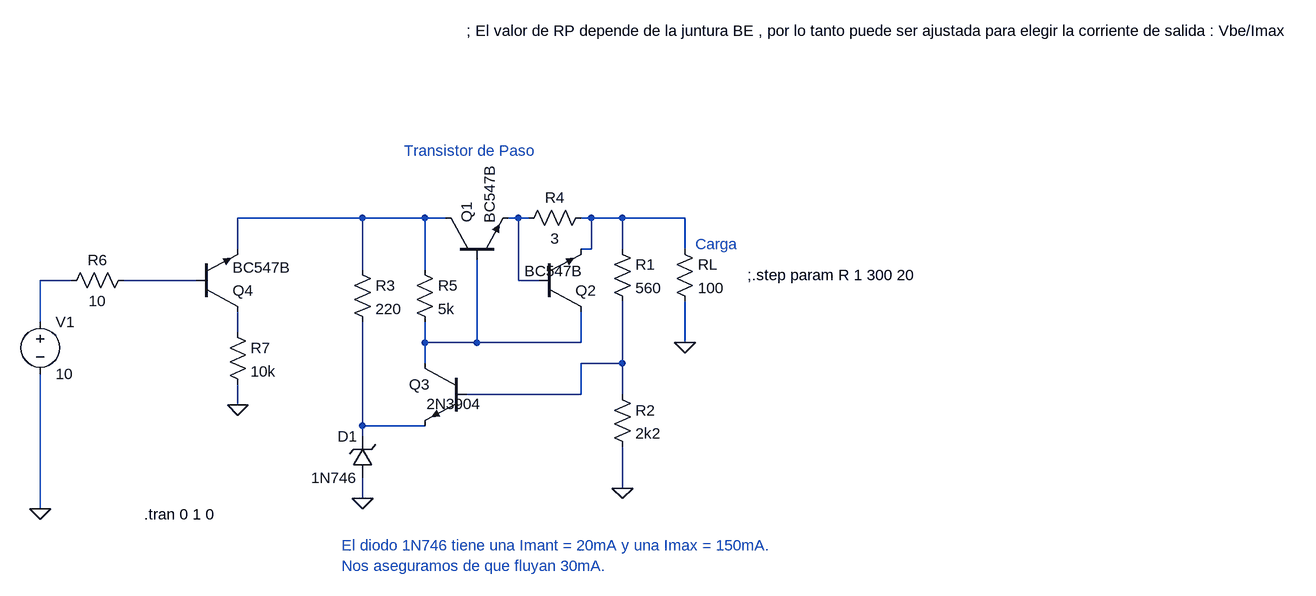
[diagram p0: schematic Fuente.asc]
Fuente.asc, the LTspice schematic file:
Version 4
SHEET 1 1496 680
WIRE -48 -48 -240 -48
WIRE 48 -48 -48 -48
WIRE 80 -48 48 -48
WIRE 192 -48 176 -48
WIRE 208 -48 192 -48
WIRE 304 -48 288 -48
WIRE 352 -48 304 -48
WIRE 448 -48 352 -48
WIRE -240 0 -240 -48
WIRE 304 0 304 -48
WIRE 304 0 288 0
WIRE 352 0 352 -48
WIRE 448 0 448 -48
WIRE -48 32 -48 -48
WIRE 48 32 48 -48
WIRE -496 48 -544 48
WIRE -304 48 -416 48
WIRE 192 48 192 -48
WIRE 224 48 192 48
WIRE -544 112 -544 48
WIRE -240 128 -240 96
WIRE 48 144 48 112
WIRE 128 144 128 16
WIRE 128 144 48 144
WIRE 288 144 288 96
WIRE 288 144 128 144
WIRE 448 144 448 80
WIRE 48 176 48 144
WIRE 352 176 352 80
WIRE 352 176 288 176
WIRE 288 224 288 176
WIRE 288 224 112 224
WIRE 352 224 352 176
WIRE -240 240 -240 208
WIRE -48 272 -48 112
WIRE 48 272 -48 272
WIRE -48 288 -48 272
WIRE 352 368 352 304
WIRE -48 384 -48 352
WIRE -544 400 -544 192
FLAG -544 400 0
FLAG -48 384 0
FLAG 352 368 0
FLAG 448 144 0
FLAG -240 240 0
DATAFLAG 432 -48 ""
DATAFLAG -80 -48 ""
SYMBOL npn 80 16 R270
SYMATTR InstName Q1
SYMATTR Value BC547B
SYMBOL res 336 -16 R0
SYMATTR InstName R1
SYMATTR Value 560
SYMBOL res 336 208 R0
SYMATTR InstName R2
SYMATTR Value 2k2
SYMBOL res -64 16 R0
SYMATTR InstName R3
SYMATTR Value 220
SYMBOL voltage -544 96 R0
WINDOW 123 0 0 Left 0
WINDOW 39 0 0 Left 0
SYMATTR InstName V1
SYMATTR Value 10
SYMBOL res 432 -16 R0
SYMATTR InstName RL
SYMATTR Value 100
SYMBOL npn 224 96 M180
WINDOW 3 -23 62 Left 2
SYMATTR Value BC547B
SYMATTR InstName Q2
SYMBOL res 304 -64 R90
WINDOW 0 0 56 VBottom 2
WINDOW 3 32 56 VTop 2
SYMATTR InstName R4
SYMATTR Value 3
SYMBOL npn 112 176 M0
WINDOW 3 -23 62 Left 2
SYMATTR Value 2N3904
SYMATTR InstName Q3
SYMBOL res 32 16 R0
SYMATTR InstName R5
SYMATTR Value 5k
SYMBOL res -400 32 R90
WINDOW 0 0 56 VBottom 2
WINDOW 3 32 56 VTop 2
SYMATTR InstName R6
SYMATTR Value 10
SYMBOL zener -32 352 R180
WINDOW 0 24 64 Left 2
WINDOW 3 24 0 Left 2
SYMATTR InstName D1
SYMATTR Value 1N746
SYMBOL npn -304 96 M180
SYMATTR InstName Q4
SYMATTR Value BC547B
SYMBOL res -256 112 R0
SYMATTR InstName R7
SYMATTR Value 10k
TEXT -384 408 Left 2 !.tran 0 1 0
TEXT 112 -336 Left 2 !; El valor de RP depende de la juntura BE , por lo tanto puede ser ajustada para elegir la corriente de salida : Vbe/Imax
TEXT -80 456 Left 2 ;El diodo 1N746 tiene una Imant = 20mA y una Imax = 150mA.\nNos aseguramos de que fluyan 30mA.
TEXT 464 -8 Left 2 ;Carga
TEXT 16 -152 Left 2 ;Transistor de Paso
TEXT 544 40 Left 2 !;.step param R 1 300 20

The netlist it stands for:
* Fuente.asc
Q1 N001 N007 N002 0 BC547B
R1 N003 N008 560
R2 N008 0 2k2
R3 N001 N009 220
V1 N004 0 10
RL N003 0 100
Q2 N007 N002 N003 0 BC547B
R4 N003 N002 3
Q3 N007 N008 N009 0 2N3904
R5 N001 N007 5k
R6 N005 N004 10
D1 0 N009 1N746
Q4 N006 N005 N001 0 BC547B
R7 N006 0 10k
.model D D
.lib standard.dio
.model NPN NPN
.model PNP PNP
.lib standard.bjt
.tran 0 1 0
; El valor de RP depende de la juntura BE , por lo tanto puede ser ajustada para elegir la corriente de salida : Vbe/Imax
* El diodo 1N746 tiene una Imant = 20mA y una Imax = 150mA.
* Nos aseguramos de que fluyan 30mA.
* Carga
* Transistor de Paso
;.step param R 1 300 20
.backanno
.end